# EAGLE design Firefly (EAGLE 9.2.1)
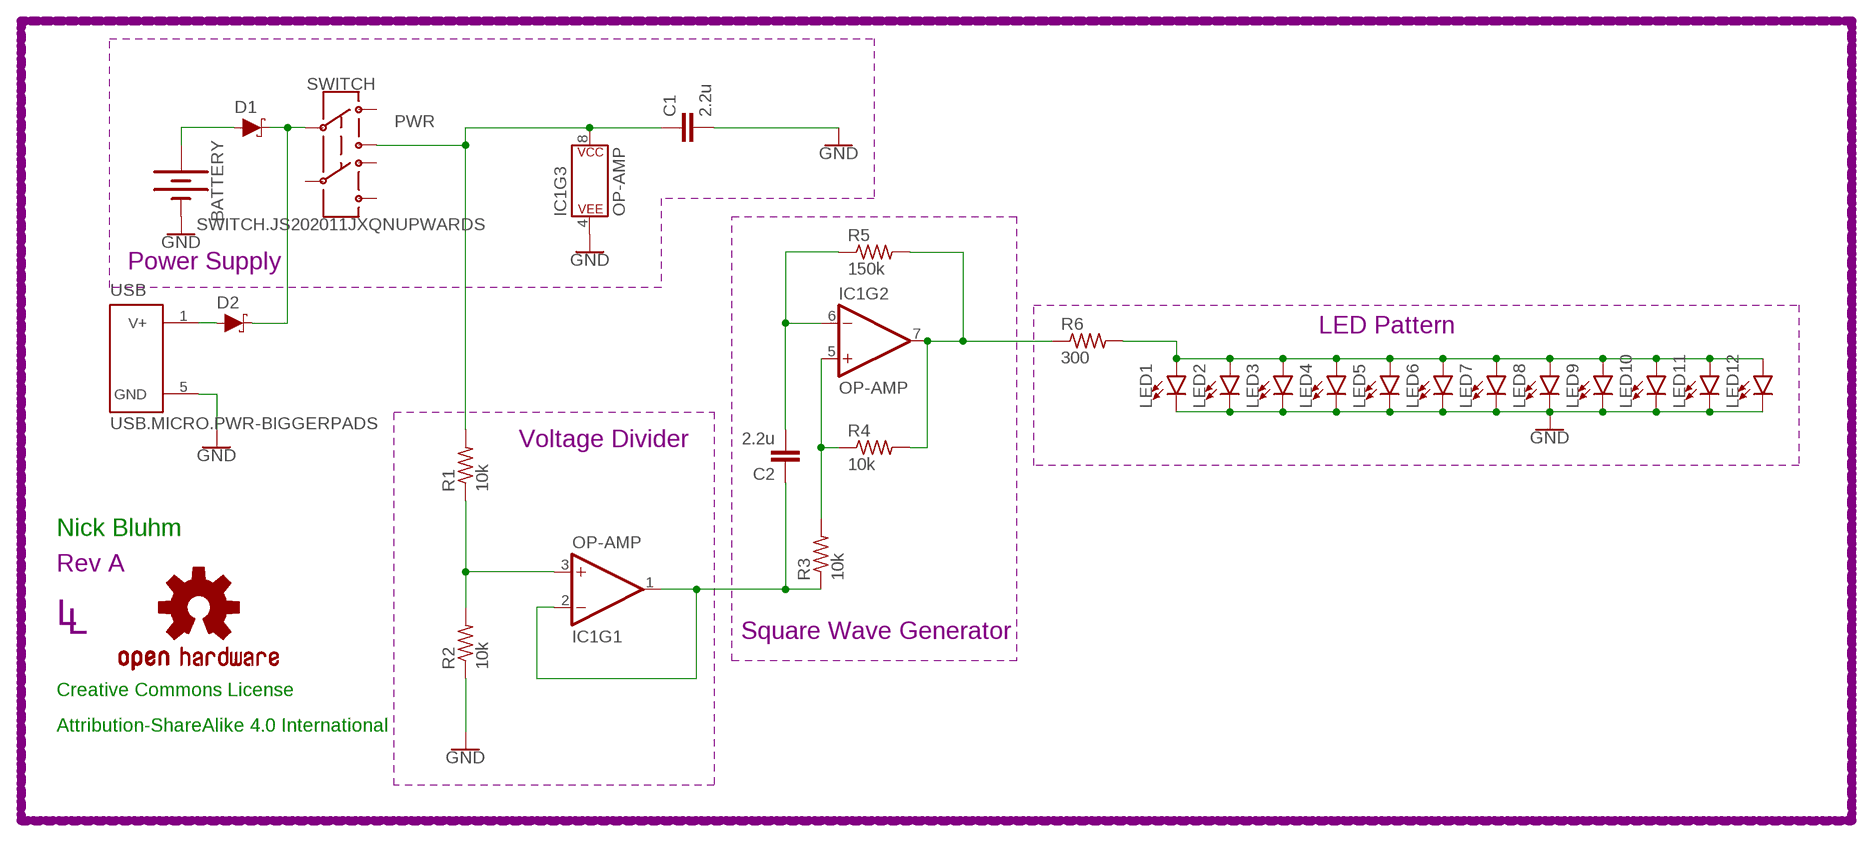
[diagram p0: schematic, sheet 1]

## Parts
BATTERY  BATTERY-20MM_SMD  [BATTCON_20MM]
C1  2.2u  CAPACITOR0603  [C0603]
C2  2.2u  CAPACITOR0603  [C0603]
D1  SCHOTTKY-USC  [USC]
D2  SCHOTTKY-USC  [USC]
IC1  OP-AMP  OPAMP-DUALU  [SO08]
LED1  LED5MM  [LED_5MM]
LED2  LED5MM  [LED_5MM]
LED3  LED5MM  [LED_5MM]
LED4  LED5MM  [LED_5MM]
LED5  LED5MM  [LED_5MM]
LED6  LED5MM  [LED_5MM]
LED7  LED5MM  [LED_5MM]
LED8  LED5MM  [LED_5MM]
LED9  LED5MM  [LED_5MM]
LED10  LED5MM  [LED_5MM]
LED11  LED5MM  [LED_5MM]
LED12  LED5MM  [LED_5MM]
LOGO1  OSHW-LOGOL  [OSHW-LOGO-L]
R1  10k  RESISTOR0603  [R0603]
R2  10k  RESISTOR0603  [R0603]
R3  10k  RESISTOR0603  [R0603]
R4  10k  RESISTOR0603  [R0603]
R5  150k  RESISTOR0603  [R0603]
R6  300  RESISTOR0603  [R0603]
SWITCH  SWITCH.JS202011JXQNUPWARDS  [SWITCH.00]
U$4  REVISION.A  [REV.A]
U$5  LINNES.LAB.LOGO  [LINNES.LAB.LOGO]
USB  USB.MICRO.PWR-BIGGERPADS  [USB-MICRO-01.BIGGERPADS.PWR]

## Nets
GND: BATTERY.2(-) C1.2 IC1.4(P$V-) LED1.K(C) LED2.K(C) LED3.K(C) LED4.K(C) LED5.K(C) LED6.K(C) LED7.K(C) LED8.K(C) LED9.K(C) LED10.K(C) LED11.K(C) LED12.K(C) R2.1 USB.5(GND)
N$1: D1.-(C) D2.-(C) SWITCH.2
N$2: IC1.3(+IN) R1.1 R2.2
N$3: LED1.A LED2.A LED3.A LED4.A LED5.A LED6.A LED7.A LED8.A LED9.A LED10.A LED11.A LED12.A R6.2
N$4: C2.1 IC1.1(OUT) IC1.2(-IN) R3.1
N$5: C2.2 IC1.6(-IN) R5.1
N$6: IC1.5(+IN) R3.2 R4.1
N$7: IC1.7(OUT) R4.2 R5.2 R6.1
N$9: BATTERY.1(+) D1.+(A)
N$11: D2.+(A) USB.1(V+)
PWR: C1.1 IC1.8(P$V+) R1.2 SWITCH.3
Unconnected: SWITCH.1 SWITCH.5 SWITCH.6 SWITCH.7

## Notes on the sheet
- Power Supply
- LED Pattern
- Voltage Divider
- Nick Bluhm
- Square Wave Generator
- Creative Commons License
- Attribution-ShareAlike 4.0 International

## Library data of the parts
BATTERY = SparkFun-Batteries:BATTERY: Battery - Single Cell A variety of battery chemistries, sizes, and footprints. Device List: 20MM_PTH - Coin Cell Battery Holder - 20mm (PTH) <https://www.sparkfun.com/products/783> 6.8MM_PTH - Coin Cell Battery Holder - 6.8MM(SMD) <https://www.digikey.com/product-detail/en/seiko-instruments/MS621FE-FL11E/728-1057-ND/1889208?WT.srch=1&gclid=CNOQ5a6LzdQCFZS2wAodXCkE0g> 12MM_SMD - Coin Cell Battery Holder - 12mm (SMD) <https://www.sparkfun.com/products/10592> 12MM_PTH - Coin Cell Battery Holder - 12mm (PTH) <https://www.sparkfun.com/products/7948> 20MM_SMD - 20mm Coin Cell Battery Holder (SMD) (2 legs) Used on the Big Time Watch Kit <https://www.sparkfun.com/products/11734> 20MM_SMD_4LEGS - Coin Cell Battery Holder - 20mm (SMD) <https://www.sparkfun.com/products/11892> 20MM_SMD_4LEGS_OVERPASTE - Coin Cell Battery Holder - 20mm (SMD) <https://www.sparkfun.com/products/11892> (Over-paste on the legs) 24.5MM_PTH - Coin Cell Battery Holder - 24.5mm (PTH) <https://www.sparkfun.com/products/8863> 9V - 9V Battery Holder - PC Mount Used on the SparkFun SparkPunk Sound Kit <https://www.sparkfun.com/products/11177> and SparkFun SparkPunk Sequencer Kit <https://www.sparkfun.com/products/12707> 18650 - Battery Holder - 18650 (PTH) <https://www.sparkfun.com/products/13113> AA - Battery Holder - 1xAA (PTH) <https://www.sparkfun.com/products/7949> AAA - Battery Holder - 1xAAA (PTH) <https://www.sparkfun.com/products/12718> AA_KIT - Battery Holder - 1xAA (PTH) <https://www.sparkfun.com/products/7949> Special kit package - pads only have exposed copper on one side of the board. AAA_KIT - Battery Holder - 1xAAA (PTH) <https://www.sparkfun.com/products/12718> Special kit package - pads only have exposed copper on one side of the board.; PROD_ID: BATT-11519
C1 C2 = CalvEngIO-Passives:CAPACITOR
D1 D2 = CalvEngIO-DiscreteSemi:SCHOTTKY: Schottky diode A Schottky diode is a semiconductor diode which has a low forward voltage drop and a very fast switching action. Example: Digi-Key Part Number: RB161MM-20CT-ND
IC1 = SparkFun-IC-Amplifiers:OPAMP-DUAL: Generic op-amp footprint This component is for the standard 358 pinning of a dual op-amp From the LM358 datasheet: Pin 1: Output A Pin 2: Inverting Input A Pin 3: Non-Inverting Input A Pin 4: Gnd Pin 5: Non-Inverting Input B Pin 6: Inverting Input B Pin 7: Output B Pin 8: V+; PROD_ID: NA-XXXXX
LED1-LED12 = CalvEngIO-LED:LED: LED (Generic) Standard schematic elements and footprints for 5mm, 3mm, 1206, and 0603 sized LEDs. Generic LEDs with no color specified. LTST-C190KGKT: arrow indicates cathode
LOGO1 = CalvEngIO-Logos:OSHW-LOGO: Open-Source Hardware (OSHW) Logo This logo indicates the piece of hardware it is found on incorporates a OSHW license and/or adheres to the definition of open source hardware found here: http://freedomdefined.org/OSHW
R1-R6 = CalvEngIO-Passives:RESISTOR
SWITCH = CalvEngIO-Switches:SWITCH.JS202011JXQN: Manufacturer's Part Numer: JS202011JAQN for right angle throw JS202011JCQN for top side throw
U$4 = CalvEngIO-Symbols:REVISION.A
U$5 = CalvEngIO-Logos:LINNES.LAB.LOGO
USB = CalvEngIO-Connectors:USB.MICRO.PWR

## Board
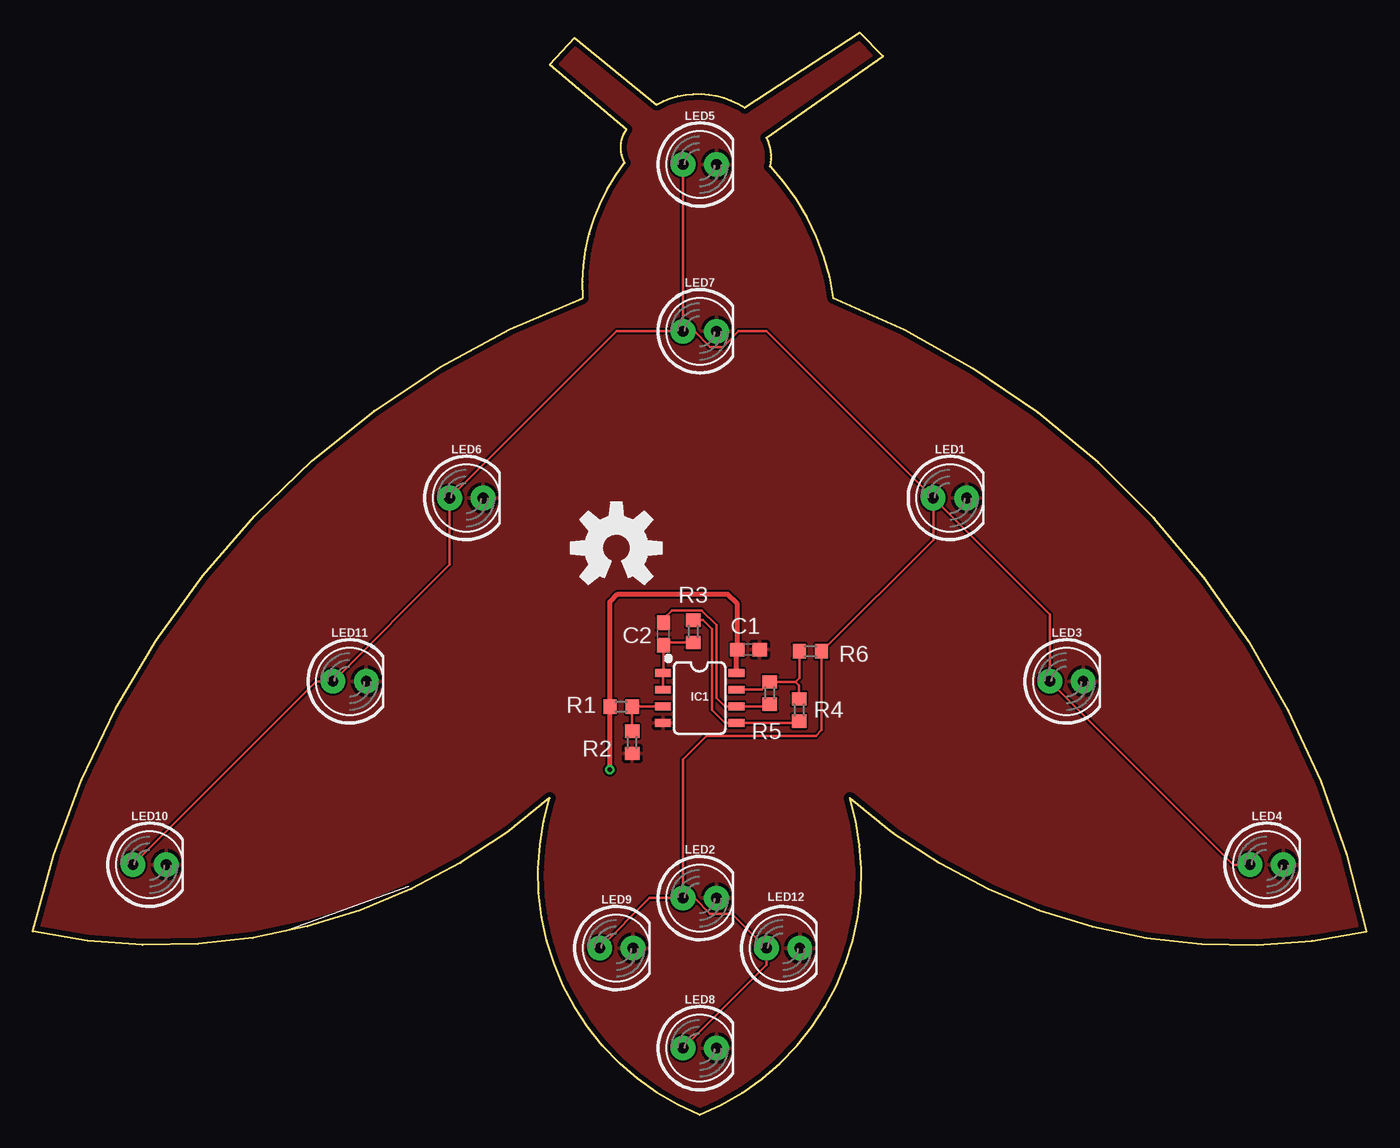
[diagram p1: board, top side]
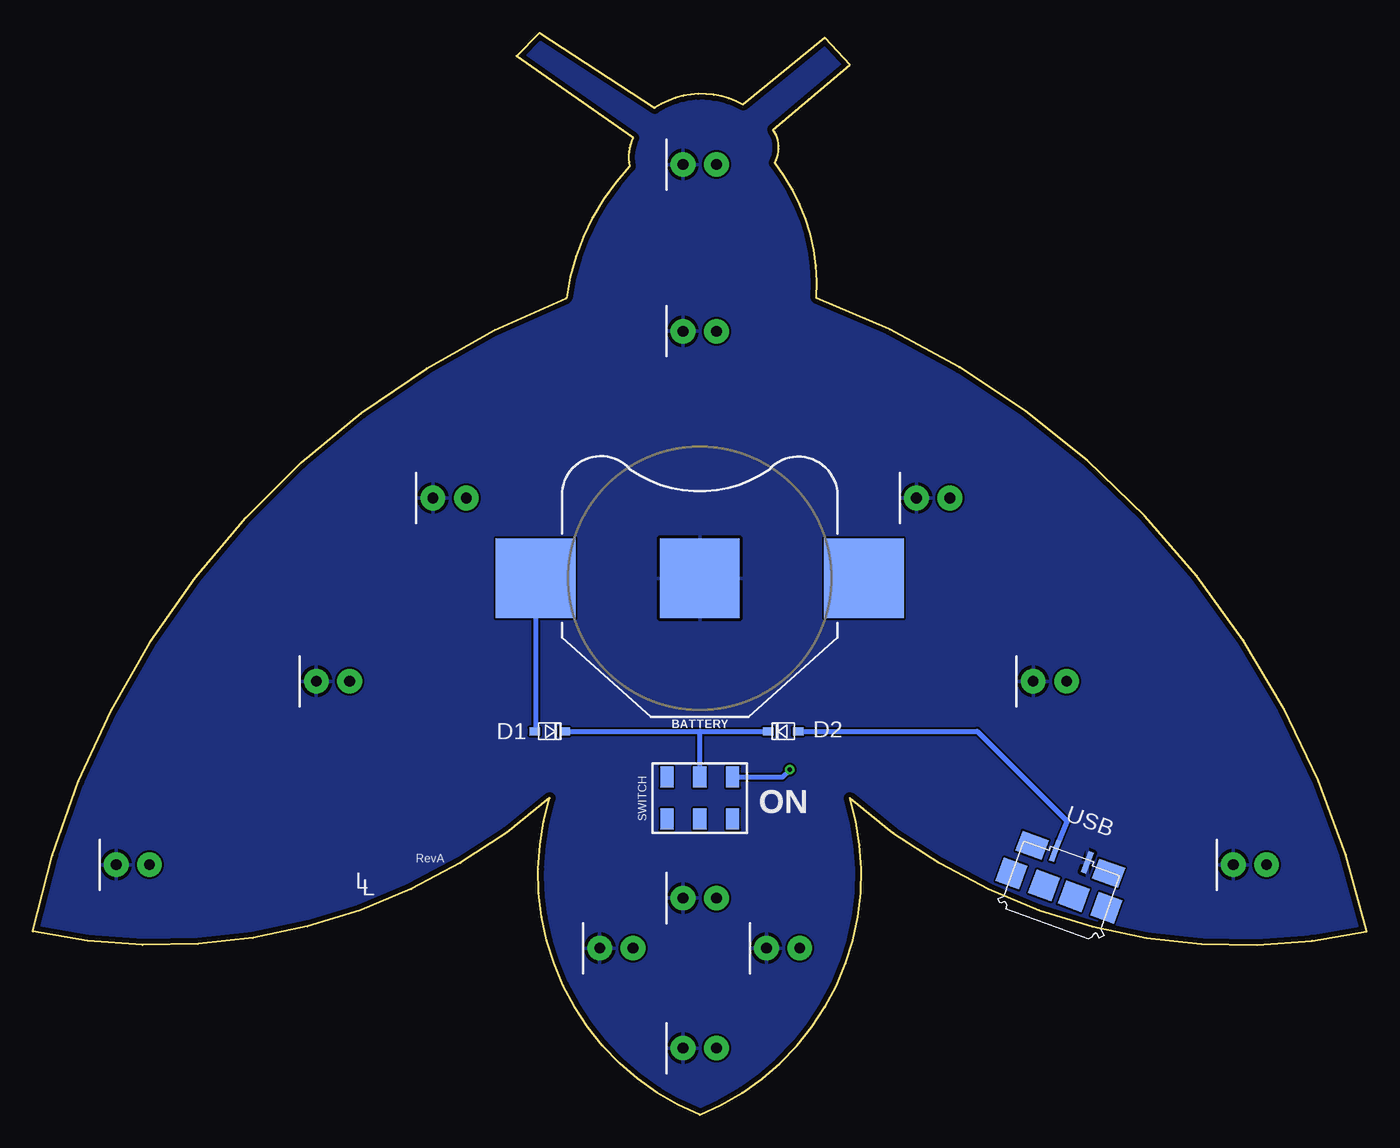
[diagram p2: board, bottom side, seen from below]

Size 101.6 x 82.42 mm. Coordinates in mm from the lower left corner, seen from the top.
Outline: 55.88,74.42 64.77,80.64 62.99,82.42 54.23,76.71 arc62 47.5,76.96 41.27,82.04 39.37,80.01 45.21,75.06 arc63 45.09,72.52 arc42 41.91,62.23 arc57 0,13.97 arc54 39.37,24.13 arc85 50.8,0 arc85 62.23,24.13 arc54 101.6,13.97 arc57 60.96,62.23 arc36 56.13,72.26 arc41 55.88,74.42
Copper layers (1*16): Top 0.0356mm / dielectric 1.5011mm / Bottom 0.0356mm
Design rules "LaenPCBOrder": minimum track width 6mil, minimum drill 13mil, track to track 6mil, track to pad 6mil, pad to pad 6mil, via to via 6mil, smd to smd 6mil, copper to edge 15mil, drill to drill 6mil, minimum pad ring 7mil, minimum via ring 7mil, stop-mask expansion 3mil, vias tented up to drill 0mil, thermal gap 10mil

### Footprints (pad centres in the part's own frame; a part is rotated, then mirrored left to right if it is on the bottom)
BATTCON_20MM = smd 6.07 x 6.07: 1 -12.5,0; 2 0,0; 3 12.5,0
C0603 = smd 1.1 x 1: 1 -0.85,0; 2 0.85,0
USC = smd 0.8 x 0.6: + -1.15,0; - 1.15,0
SO08 = smd 0.6 x 1.2: 1 -1.905,-2.8; 2 -0.635,-2.8; 3 0.635,-2.8; 4 1.905,-2.8; 5 1.905,2.8; 6 0.635,2.8; 7 -0.635,2.8; 8 -1.905,2.8
LED_5MM = drill 0.813 pad 1.88: A -1.27,0; K 1.27,0
R0603 = smd 1 x 1.1: 1 -0.85,0; 2 0.85,0
SWITCH.00 = smd 1 x 1.6: 1 -2.5,1.6; 2 0,1.6; 3 2.5,1.6; 5 -2.5,-1.6; 6 0,-1.6; 7 2.5,-1.6
USB-MICRO-01.BIGGERPADS.PWR = smd 0.4 x 1.7: 1 -1.3,2.775; 5 1.3,2.775 | smd 1.9 x 1.9: SOLDER-1 -3.85,0; SOLDER-2 -1.2,0; SOLDER-3 1.2,0; SOLDER-4 3.85,0 | smd 2.1 x 1.6: SOLDER-5 -3.1,2.55; SOLDER-6 3.1,2.55

### Placement (x,y rotation side)
BATTERY  50.8,40.87 0 bottom
C1  54.51,35.43 0 top
C2  48.03,36.63 90 top
D1  62.23,29.21 0 bottom
D2  44.45,29.21 180 bottom
IC1  50.8,31.75 270 top
LED1  69.85,46.99 0 top
LED2  50.8,16.51 0 top
LED3  78.74,33.02 0 top
LED4  93.98,19.05 0 top
LED5  50.8,72.39 0 top
LED6  33.02,46.99 0 top
LED7  50.8,59.69 0 top
LED8  50.8,5.08 0 top
LED9  44.45,12.7 0 top
LED10  8.89,19.05 0 top
LED11  24.13,33.02 0 top
LED12  57.15,12.7 0 top
LOGO1  44.45,43.18 0 top
R1  44.81,31.09 180 top
R2  45.64,28.37 90 top
R3  50.29,36.83 90 top
R4  58.37,30.84 90 top
R5  56.13,32.13 90 top
R6  59.23,35.31 0 top
SWITCH  50.8,24.13 0 bottom
U$4  72.44,19.23 0 bottom
U$5  77.04,17.22 0 bottom
USB  23.44,17.07 340 bottom

### Tracks (layer width: path | path; a pad name or v marks a point on that pad's centre or on a via)
GND
  pour Bottom: 0,99.06 173.99,99.06 175.26,97.79 175.26,-6.35 166.37,-15.24 6.35,-15.24 -3.81,-5.08 -3.81,93.98 0,97.79
  pour Top: 0,100.33 0,-15.24 109.22,-15.24 109.22,97.79
N$1
  Bottom 0.381: D1.- 50.75,29.21 | 50.75,29.21 D2.- | SWITCH.2 50.8,27.51 | 50.8,27.51 50.8,29.16 50.75,29.21 | 50.8,27.51
N$2
  Top 0.203: IC1.3 45.68,31.12 R1.1 45.64,31.08 R2.2
N$3
  Top 0.203: LED10.A 21.59,33.02 LED11.A 31.75,41.91 LED6.A 44.45,59.69 LED7.A | LED7.A LED5.A | LED1.A 55.88,59.69 53.76,59.69 52.56,58.5 51.58,58.5 50.38,59.69 LED7.A | LED1.A 77.47,38.1 LED3.A 91.44,19.05 LED4.A | LED8.A 55.88,11.43 LED12.A 53.26,15.32 51.58,15.32 50.38,16.51 LED2.A | LED2.A 46.99,16.51 LED9.A | LED2.A 49.53,27.09 51.32,28.88 59.63,28.88 60.08,29.32 R6.2 68.58,43.8 LED1.A
N$4
  Top 0.203: IC1.2 IC1.1 48.03,33.69 C2.1 48.23,35.98 R3.1
N$5
  Top 0.203: R5.1 55.97,31.12 IC1.6 52.7,31.12 52.07,31.75 52.07,37.31 50.95,38.43 48.67,38.43 48.03,37.8 C2.2
N$6
  Top 0.203: R3.2 51.05,37.68 51.71,37.02 51.71,30.84 52.7,29.84 IC1.5 58.23,29.84 R4.1
N$7
  Top 0.203: IC1.7 55.54,32.39 R5.2 58.1,32.98 | R6.1 58.38,33.26 58.1,32.98 | 58.1,32.98 58.37,32.71 R4.2
N$9
  Bottom 0.203: 63.3,29.29 D1.+
  Bottom 0.381: BATTERY.1 63.3,29.29
N$11
  Bottom 0.381: D2.+ 29.67,29.21 22.81,22.35 23.7,20.14 USB.1
PWR  (via drill 0.35)
  Top 0.381: IC1.8 53.6,35.38 C1.1 53.66,38.9 52.88,39.68 44.55,39.68 43.96,39.08 R1.2 43.96,26.3 v43.94,26.29
  Bottom 0.381: v43.94,26.29 44.5,25.73 SWITCH.3

### Text on the board
bNames: ON